# EAGLE design c64saver_1.3 (EAGLE 6.0)
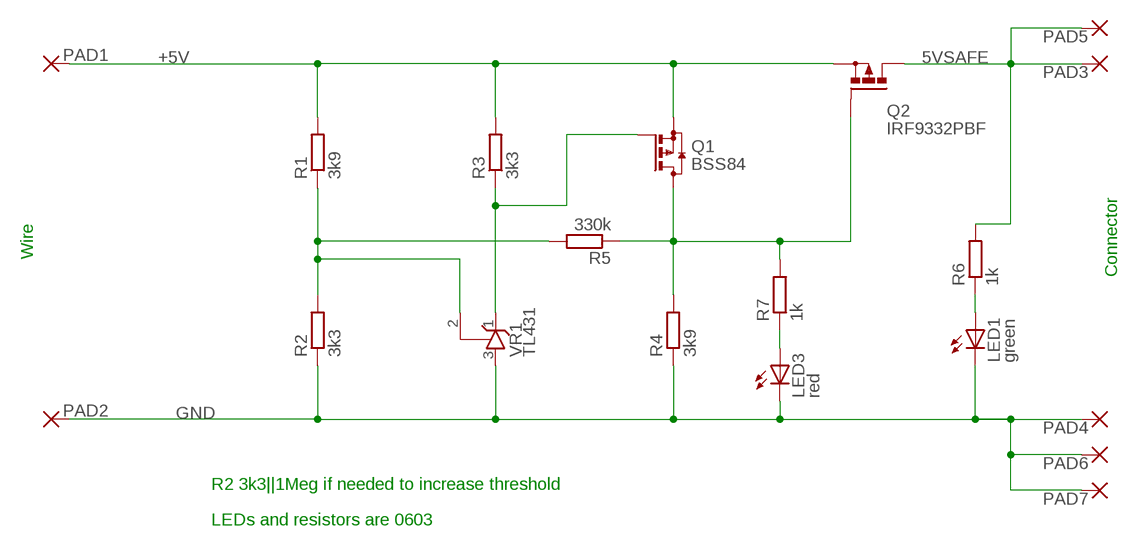
[diagram p0: schematic, sheet 1]

## Parts
LED1  green  LEDCHIPLED_0603  [CHIPLED_0603]
LED3  red  LEDCHIPLED_0603  [CHIPLED_0603]
PAD1  WIREPADSMD1,27-254  [SMD1,27-2,54]
PAD2  WIREPADSMD1,27-254  [SMD1,27-2,54]
PAD3  WIREPADSMD2,54-2,54  [SMD2,54-2,54]
PAD4  WIREPADSMD1,27-254  [SMD1,27-2,54]
PAD5  WIREPADSMD2,54-2,54  [SMD2,54-2,54]
PAD6  WIREPADSMD1,27-254  [SMD1,27-2,54]
PAD7  WIREPADSMD1,27-254  [SMD1,27-2,54]
Q1  BSS84  [SOT23]
Q2  IRF9332PBF  P-MOSFET-SO8  [SO-08]
R1  3k9  R-EU_R0603  [R0603]
R2  3k3  R-EU_R0603  [R0603]
R3  3k3  R-EU_R0603  [R0603]
R4  3k9  R-EU_R0603  [R0603]
R5  330k  R-EU_R0603  [R0603]
R6  1k  R-EU_R0603  [R0603]
R7  1k  R-EU_R0603  [R0603]
VR1  TL431  TL431CLPSOT23  [SOT23]

## Nets
5VSAFE: PAD3.1(P) PAD5.1(P) Q2.5(D) Q2.6(D) Q2.7(D) Q2.8(D) R6.2
+5V: PAD1.1(P) Q1.2(S) Q2.1(S) Q2.2(S) Q2.3(S) R1.2 R3.2
GND: LED1.C LED3.C PAD2.1(P) PAD4.1(P) PAD6.1(P) PAD7.1(P) R2.1 R4.1 VR1.3(A)
N$1: LED3.A R7.1
N$2: R1.1 R2.2 R5.2 VR1.2(R)
N$3: LED1.A R6.1
N$5: Q1.1(G) R3.1 VR1.1(C)
N$7: Q1.3(D) Q2.4(G) R4.2 R5.1 R7.2

## Notes on the sheet
- Wire
- Connector
- R2 3k3||1Meg if needed to increase threshold
- LEDs and resistors are 0603

## Library data of the parts
LED1 LED3 = led:LED: LED OSRAM: - CHIPLED LG R971, LG N971, LY N971, LG Q971, LY Q971, LO R971, LY R971 LH N974, LH R974 LS Q976, LO Q976, LY Q976 LO Q996 - Hyper CHIPLED LW Q18S LB Q993, LB Q99A, LB R99A - SideLED LS A670, LO A670, LY A670, LG A670, LP A670 LB A673, LV A673, LT A673, LW A673 LH A674 LY A675 LS A676, LA A676, LO A676, LY A676, LW A676 LS A679, LY A679, LG A679 - Hyper Micro SIDELED® LS Y876, LA Y876, LO Y876, LY Y876 LT Y87S - SmartLED LW L88C, LW L88S LB L89C, LB L89S, LG L890 LS L89K, LO L89K, LY L89K LS L896, LA L896, LO L896, LY L896 - TOPLED LS T670, LO T670, LY T670, LG T670, LP T670 LSG T670, LSP T670, LSY T670, LOP T670, LYG T670 LG T671, LOG T671, LSG T671 LB T673, LV T673, LT T673, LW T673 LH T674 LS T676, LA T676, LO T676, LY T676, LB T676, LH T676, LSB T676, LW T676 LB T67C, LV T67C, LT T67C, LS T67K, LO T67K, LY T67K, LW E67C LS E67B, LA E67B, LO E67B, LY E67B, LB E67C, LV E67C, LT E67C LW T67C LS T679, LY T679, LG T679 LS T770, LO T770, LY T770, LG T770, LP T770 LB T773, LV T773, LT T773, LW T773 LH T774 LS E675, LA E675, LY E675, LS T675 LS T776, LA T776, LO T776, LY T776, LB T776 LHGB T686 LT T68C, LB T68C - Hyper Mini TOPLED® LB M676 - Mini TOPLED Santana® LG M470 LS M47K, LO M47K, LY M47K Source: http://www.osram.convergy.de LUXEON: - LUMILED® LXK2-PW12-R00, LXK2-PW12-S00, LXK2-PW14-U00, LXK2-PW14-V00 LXK2-PM12-R00, LXK2-PM12-S00, LXK2-PM14-U00 LXK2-PE12-Q00, LXK2-PE12-R00, LXK2-PE12-S00, LXK2-PE14-T00, LXK2-PE14-U00 LXK2-PB12-K00, LXK2-PB12-L00, LXK2-PB12-M00, LXK2-PB14-N00, LXK2-PB14-P00, LXK2-PB14-Q00 LXK2-PR12-L00, LXK2-PR12-M00, LXK2-PR14-Q00, LXK2-PR14-R00 LXK2-PD12-Q00, LXK2-PD12-R00, LXK2-PD12-S00 LXK2-PH12-R00, LXK2-PH12-S00 LXK2-PL12-P00, LXK2-PL12-Q00, LXK2-PL12-R00 Source: www.luxeon.com KINGBRIGHT: KA-3528ASYC Source: www.kingbright.com
PAD1-PAD7 = wirepad:WIREPAD: Wire PAD connect wire on PCB
Q1 = transistor-small-signal:BSS84: P-CHANNEL MOS FET
Q2 = transistor-power:P-MOSFET-SO8: P-Channel MOSFET Example: FDS4435A; P-Channel Logic Level PowerTrench® MOSFET FDS4465; P-Channel 1.8V Specified PowerTrench® MOSFET Source: www.fairchildsemi.com
R1-R7 = rcl:R-EU_: RESISTOR, European symbol
VR1 = v-reg:TL431CLP: VOLTAGE REGULATOR

## Board
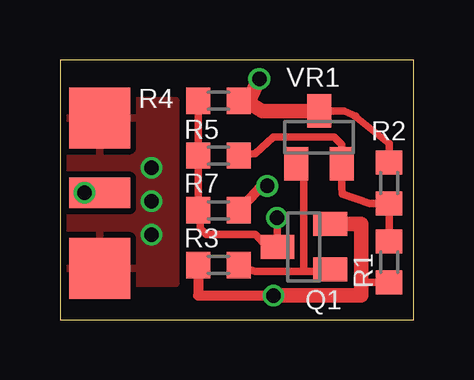
[diagram p1: board, top side]
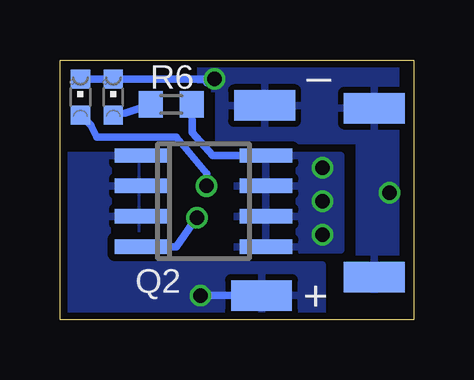
[diagram p2: board, bottom side, seen from below]

Size 14.75 x 10.85 mm. Coordinates in mm from the lower left corner, seen from the top.
Outline: 0,0 14.75,0 14.75,10.85 0,10.85 0,0
Copper layers (1*16): Top 0.035mm / dielectric 1.5mm / Bottom 0.035mm
Design rules: minimum track width 5mil, minimum drill 12mil, track to track 5mil, track to pad 5mil, pad to pad 5mil, via to via 5mil, smd to smd 0mil, copper to edge 10mil, drill to drill 10mil, minimum pad ring 10mil, minimum via ring 6mil, stop-mask expansion 2mil, vias tented up to drill 25mil, thermal gap 10mil

### Footprints (pad centres in the part's own frame; a part is rotated, then mirrored left to right if it is on the bottom)
CHIPLED_0603 = smd 0.8 x 0.8: A 0,-0.75; C 0,0.75
SMD1,27-2,54 = smd 1.27 x 2.54: 1 0,0
SMD2,54-2,54 = smd 2.54 x 2.54: 1 0,0
SOT23 = smd 1 x 1.4: 1 -0.95,-1.1; 2 0.95,-1.1; 3 0,1.1
SO-08 = smd 0.6 x 2.2: 1 -1.905,-2.6; 2 -0.635,-2.6; 3 0.635,-2.6; 4 1.905,-2.6; 5 1.905,2.6; 6 0.635,2.6; 7 -0.635,2.6; 8 -1.905,2.6
R0603 = smd 1 x 1.1: 1 -0.85,0; 2 0.85,0

### Placement (x,y rotation side)
LED1  12.52,9.3 0 bottom
LED3  13.89,9.3 0 bottom
PAD1  6.35,1.02 270 bottom
PAD2  6.22,8.94 270 bottom
PAD3  1.65,2.15 270 top
PAD4  1.65,5.3 270 top
PAD5  1.65,8.42 270 top
PAD6  1.65,8.83 270 bottom
PAD7  1.65,1.78 270 bottom
Q1  10.16,3.05 90 top
Q2  8.76,4.95 270 bottom
R1  13.72,2.41 270 top
R2  13.72,5.71 270 top
R3  6.6,2.29 180 top
R4  6.6,9.14 180 top
R5  6.6,6.86 0 top
R6  10.11,8.99 0 bottom
R7  6.6,4.57 180 top
VR1  10.79,7.62 0 top

### Tracks (layer width: path | path; a pad name or v marks a point on that pad's centre or on a via)
5VSAFE  (via drill 0.6)
  Bottom 0.305: Q2.8 8.38,6.86 9.25,7.82 R6.2
  other vias: 3.81,6.35 3.81,4.95 3.81,3.56
  pour Bottom (isolate 0.305): 3.05,6.86 7.37,6.86 7.37,2.92 3.05,2.92
  pour Top (isolate 0.254): 0.25,9.14 4.83,9.14 4.83,1.52 0.25,1.52
+5V  (via drill 0.6)
  Top 0.305: 12.55,4 | 12.55,1.57 R1.2 | R3.2 5.75,1.87
  Top 0.406: 5.75,1.87 5.75,1.02 v8.89,1.02
  Top 0.61: Q1.2 12.55,4 12.55,1.57 | 12.55,4 12.55,1.02 v8.89,1.02
  Bottom 0.305: v8.89,1.02 PAD1.1
  pour Bottom (isolate 0.305): 11.56,6.86 11.56,2.29 3.81,2.29 3.81,0 14.75,0 14.75,6.86
GND  (via drill 0.6)
  Top 0.305: VR1.3 11.85,8.72 12.32,8.51 12.28,8.51 13.72,7.37 R2.1 13.97,6.86 | R4.1 7.79,9.11 7.83,9.11
  Top 0.406: PAD4.1 1.91,5.31 v1.02,5.31
  Top 0.61: 7.79,9.11 8.43,8.72 VR1.3 | 7.83,9.11 v8.31,10.06
  Bottom 0.305: 8.13,9.91 8.14,9.89 8.64,9.91 8.64,10.05 LED1.C LED3.C
  pour Bottom (isolate 0.305): 0.76,10.79 0.76,1.27 2.29,1.27 2.29,7.47 8.13,7.49 8.13,9.65 8.89,9.65 8.89,10.67 8.76,10.79
N$1  (via drill 0.6)
  Top 0.406: v8.64,5.59 8.38,5.59 R7.1
  Bottom 0.305: LED3.A 13.46,8.13 13.21,7.62 9.91,7.62 8.64,6.1 v8.64,5.59
N$2
  Top 0.305: R1.1 R2.2 12.91,4.87 11.76,5.26 11.75,5.55 VR1.2 11.74,7.3 11.43,7.62 8.89,7.62 8.13,6.95 R5.2
N$3
  Bottom 0.305: LED1.A 12.03,8.64 R6.1
N$5
  Top 0.305: VR1.1 10.16,7.03 10.16,2.03 | 10.16,2.03 11.26,2.03 Q1.1 | R3.1 7.37,2.29 8.13,2.03 10.16,2.03
N$7  (via drill 0.6)
  Top 0.305: R4.2 5.77,8.8 R5.1 R7.2 5.84,4.48 5.84,3.81 6.1,3.56 8.13,3.56 8.64,3.05 Q1.3 v9.04,4.27
  Bottom 0.305: Q2.4 9.91,3.05 v9.04,4.27

### Text on the board
bNames: _ | +